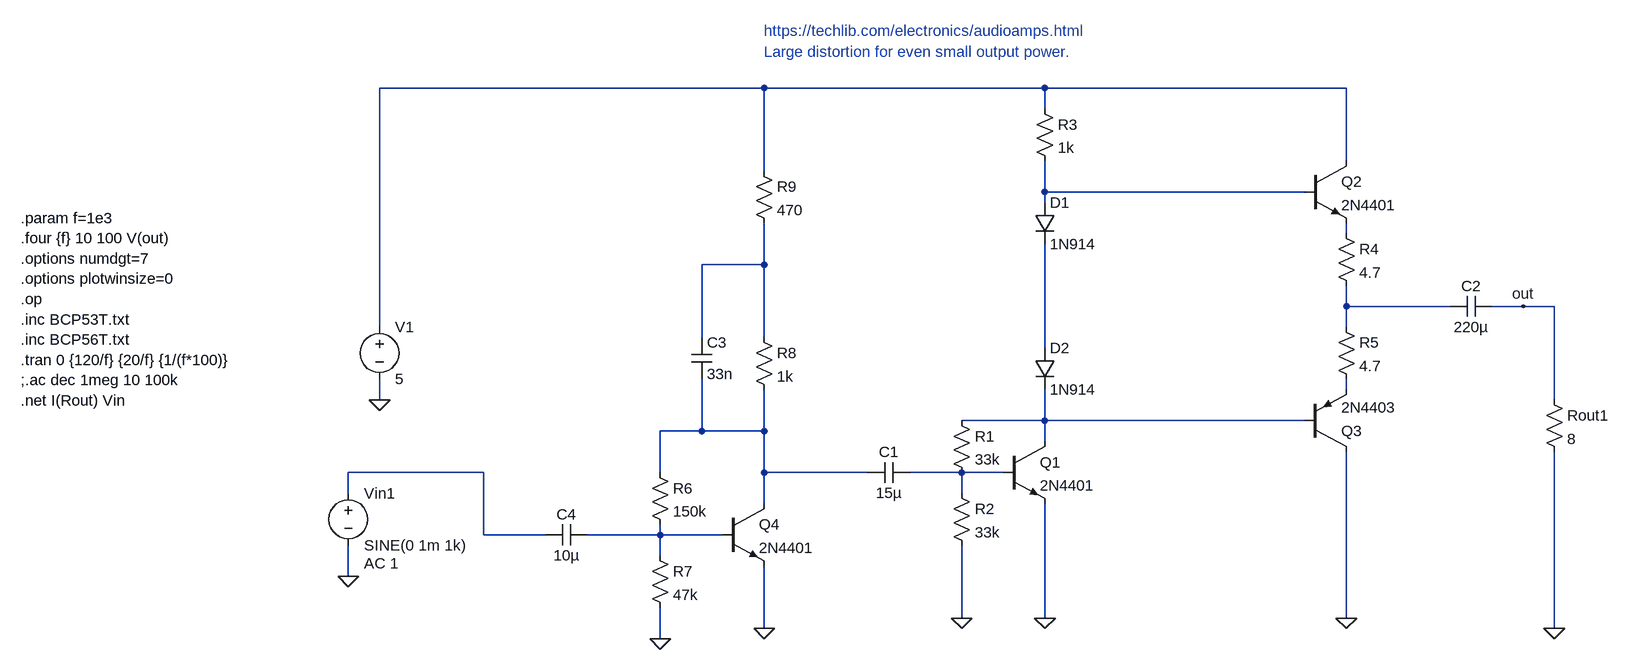
[diagram p0: schematic Techlib.asc]
Techlib.asc, the LTspice schematic file:
Version 4
SHEET 1 1524 680
WIRE 160 -240 -432 -240
WIRE 592 -240 160 -240
WIRE 1056 -240 592 -240
WIRE 592 -208 592 -240
WIRE 1056 -128 1056 -240
WIRE 160 -112 160 -240
WIRE 592 -80 592 -128
WIRE 992 -80 592 -80
WIRE 592 -64 592 -80
WIRE 1056 -16 1056 -32
WIRE 160 32 160 -32
WIRE 160 32 64 32
WIRE 1056 96 1056 64
WIRE 1216 96 1056 96
WIRE 1328 96 1280 96
WIRE 1376 96 1328 96
WIRE -432 128 -432 -240
WIRE 1056 128 1056 96
WIRE 64 144 64 32
WIRE 160 144 160 32
WIRE 592 160 592 0
WIRE 1056 224 1056 208
WIRE -432 240 -432 208
WIRE 1376 240 1376 96
WIRE 592 272 592 224
WIRE 592 272 464 272
WIRE 992 272 592 272
WIRE 64 288 64 208
WIRE 64 288 0 288
WIRE 160 288 160 224
WIRE 160 288 64 288
WIRE 592 304 592 272
WIRE -272 352 -480 352
WIRE 0 352 0 288
WIRE 160 352 160 288
WIRE 320 352 160 352
WIRE 464 352 384 352
WIRE 528 352 464 352
WIRE -480 384 -480 352
WIRE 464 384 464 352
WIRE 160 400 160 352
WIRE -272 448 -272 352
WIRE -176 448 -272 448
WIRE 0 448 0 432
WIRE 0 448 -112 448
WIRE 96 448 0 448
WIRE 0 480 0 448
WIRE -480 512 -480 464
WIRE 464 576 464 464
WIRE 592 576 592 400
WIRE 1056 576 1056 320
WIRE 160 592 160 496
WIRE 1376 592 1376 320
WIRE 0 608 0 560
FLAG -432 240 0
FLAG -480 512 0
FLAG 464 576 0
FLAG 592 576 0
FLAG 1056 576 0
FLAG 1376 592 0
FLAG 1328 96 out
FLAG 0 608 0
FLAG 160 592 0
DATAFLAG 1136 96 ""
DATAFLAG 816 -80 ""
DATAFLAG 800 272 ""
DATAFLAG -96 448 ""
SYMBOL voltage -432 112 R0
SYMATTR InstName V1
SYMATTR Value 5
SYMBOL res 448 256 R0
SYMATTR InstName R1
SYMATTR Value 33k
SYMBOL res 448 368 R0
SYMATTR InstName R2
SYMATTR Value 33k
SYMBOL npn 528 304 R0
SYMATTR InstName Q1
SYMATTR Value 2N4401
SYMBOL npn 992 -128 R0
SYMATTR InstName Q2
SYMATTR Value 2N4401
SYMBOL pnp 992 320 M180
SYMATTR InstName Q3
SYMATTR Value 2N4403
SYMBOL res 576 -224 R0
SYMATTR InstName R3
SYMATTR Value 1k
SYMBOL res 1360 224 R0
SYMATTR InstName Rout1
SYMATTR Value 8
SYMBOL voltage -480 368 R0
WINDOW 123 24 124 Left 2
WINDOW 39 0 0 Left 0
SYMATTR Value2 AC 1
SYMATTR InstName Vin1
SYMATTR Value SINE(0 1m 1k)
SYMBOL cap 384 336 R90
WINDOW 0 0 32 VBottom 2
WINDOW 3 32 32 VTop 2
SYMATTR InstName C1
SYMATTR Value 15µ
SYMBOL cap 1280 80 R90
WINDOW 0 0 32 VBottom 2
WINDOW 3 32 32 VTop 2
SYMATTR InstName C2
SYMATTR Value 220µ
SYMBOL diode 576 -64 R0
SYMATTR InstName D1
SYMATTR Value 1N914
SYMBOL diode 576 160 R0
SYMATTR InstName D2
SYMATTR Value 1N914
SYMBOL res 1040 -32 R0
SYMATTR InstName R4
SYMATTR Value 4.7
SYMBOL res 1040 112 R0
SYMATTR InstName R5
SYMATTR Value 4.7
SYMBOL npn 96 400 R0
SYMATTR InstName Q4
SYMATTR Value 2N4401
SYMBOL res -16 336 R0
SYMATTR InstName R6
SYMATTR Value 150k
SYMBOL res -16 464 R0
SYMATTR InstName R7
SYMATTR Value 47k
SYMBOL res 144 128 R0
SYMATTR InstName R8
SYMATTR Value 1k
SYMBOL res 144 -128 R0
SYMATTR InstName R9
SYMATTR Value 470
SYMBOL cap 48 144 R0
SYMATTR InstName C3
SYMATTR Value 33n
SYMBOL cap -112 432 R90
WINDOW 0 0 32 VBottom 2
WINDOW 3 32 32 VTop 2
SYMATTR InstName C4
SYMATTR Value 10µ
TEXT -984 -40 Left 2 !.param f=1e3\n.four {f} 10 100 V(out)\n.options numdgt=7\n.options plotwinsize=0\n.op\n.inc BCP53T.txt\n.inc BCP56T.txt\n.tran 0 {120/f} {20/f} {1/(f*100)}\n;.ac dec 1meg 10 100k\n.net I(Rout) Vin
TEXT 160 -328 Left 2 ;https://techlib.com/electronics/audioamps.html
TEXT 160 -296 Left 2 ;Large distortion for even small output power.

The netlist it stands for:
* Techlib.asc
V1 N001 0 5
R1 N008 N011 33k
R2 N011 0 33k
Q1 N008 N011 0 0 2N4401
Q2 N001 N002 N003 0 2N4401
Q3 0 N008 N007 0 2N4403
R3 N001 N002 1k
Rout1 out 0 8
Vin1 N010 0 SINE(0 1m 1k) AC 1
C1 N011 N009 15µ
C2 out N005 220µ
D1 N002 N006 1N914
D2 N006 N008 1N914
R4 N003 N005 4.7
R5 N005 N007 4.7
Q4 N009 N012 0 0 2N4401
R6 N009 N012 150k
R7 N012 0 47k
R8 N004 N009 1k
R9 N001 N004 470
C3 N004 N009 33n
C4 N012 N010 10µ
.model D D
.lib standard.dio
.model NPN NPN
.model PNP PNP
.lib standard.bjt
.param f=1e3
.four {f} 10 100 V(out)
.options numdgt=7
.options plotwinsize=0
.op
.inc BCP53T.txt
.inc BCP56T.txt
.tran 0 {120/f} {20/f} {1/(f*100)}
;.ac dec 1meg 10 100k
.net I(Rout) Vin
* https://techlib.com/electronics/audioamps.html
* Large distortion for even small output power.
.backanno
.end